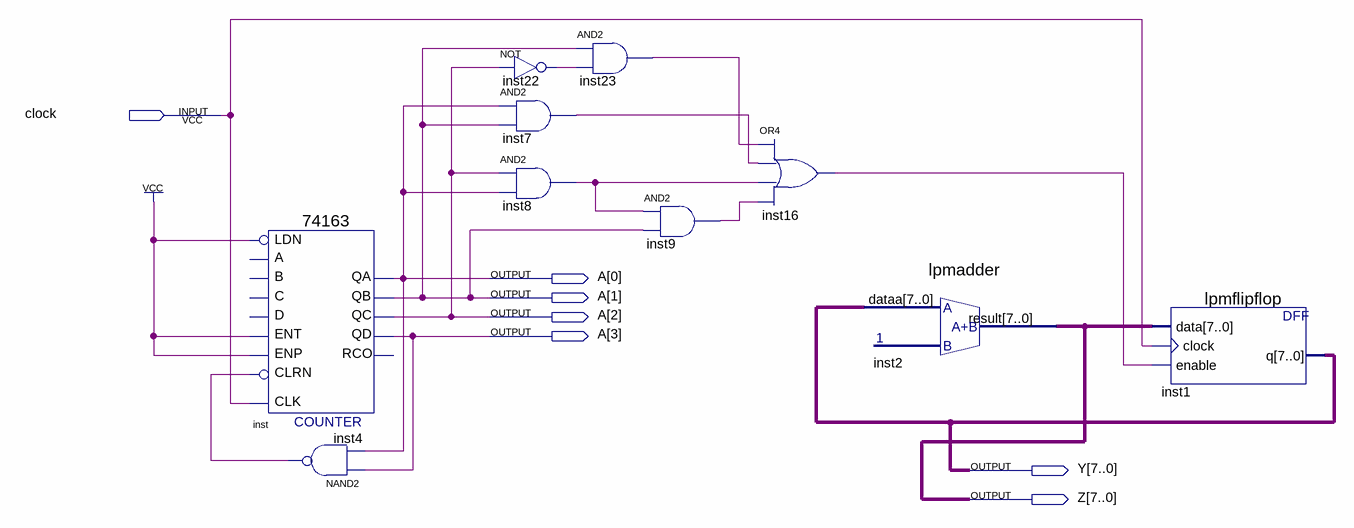
[diagram p0: schematic sheet]
// Quartus schematic prime.bdf as structural Verilog: 10 symbols, 7 pins
module prime (
  input  clock,
  output [3:0] A,
  output [7:0] Y,
  output [7:0] Z
);

  wire inst4_out, inst7_out, inst8_out, inst9_out, inst16_out, inst22_out, inst23_out;

  \74163  inst (
    .ENT(1'b1), .CLRN(inst4_out), .CLK(clock), .ENP(1'b1), .LDN(1'b1), .QA(A[0]), .QB(A[1]), .QC(A[2]),
    .QD(A[3]));  // open: C, B, A, D, RCO
  nand inst4 (inst4_out, A[3], A[0]);
  not inst22 (inst22_out, A[2]);
  and inst7 (inst7_out, A[0], A[1]);
  and inst8 (inst8_out, A[2], A[0]);
  and inst23 (inst23_out, A[1], inst22_out);
  and inst9 (inst9_out, inst8_out, A[1]);
  or inst16 (inst16_out, inst23_out, inst7_out, inst8_out, inst9_out);
  lpmadder inst2 (.dataa(Y), .result(Z));
  lpmflipflop inst1 (.data(Z), .clock(clock), .enable(inst16_out), .q(Y));
endmodule
